# Altium schematic sheet SC942C_ETOR1.SchDoc: Entrées TOR 1/2
size 393 x 270 mm; CompanyName: Seccom; Address1: 521, rue du capt. François Garbit; Address2: 69440 Mornant; Address3: seccom@seccom.fr; Address4: www.seccom.fr; DocumentNumber: 3; SheetNumber: 3; SheetTotal: 8; PageSetup: Record=PageOptions|CenterHorizontal=True|CenterVertical=True|PrintScale=0.74|XCorrection=1.00|YCorrection=1.00|PrintKind=0|BorderSize=5000000|LeftOffset=0|BottomOffset=0|Orientation=2|PaperLength=1000|PaperWidth=1000|Scale=100|PaperSource=7|PrintQuality=-4|MediaType=1|DitherType=10|PaperKind=A4|PrintScaleMode=1
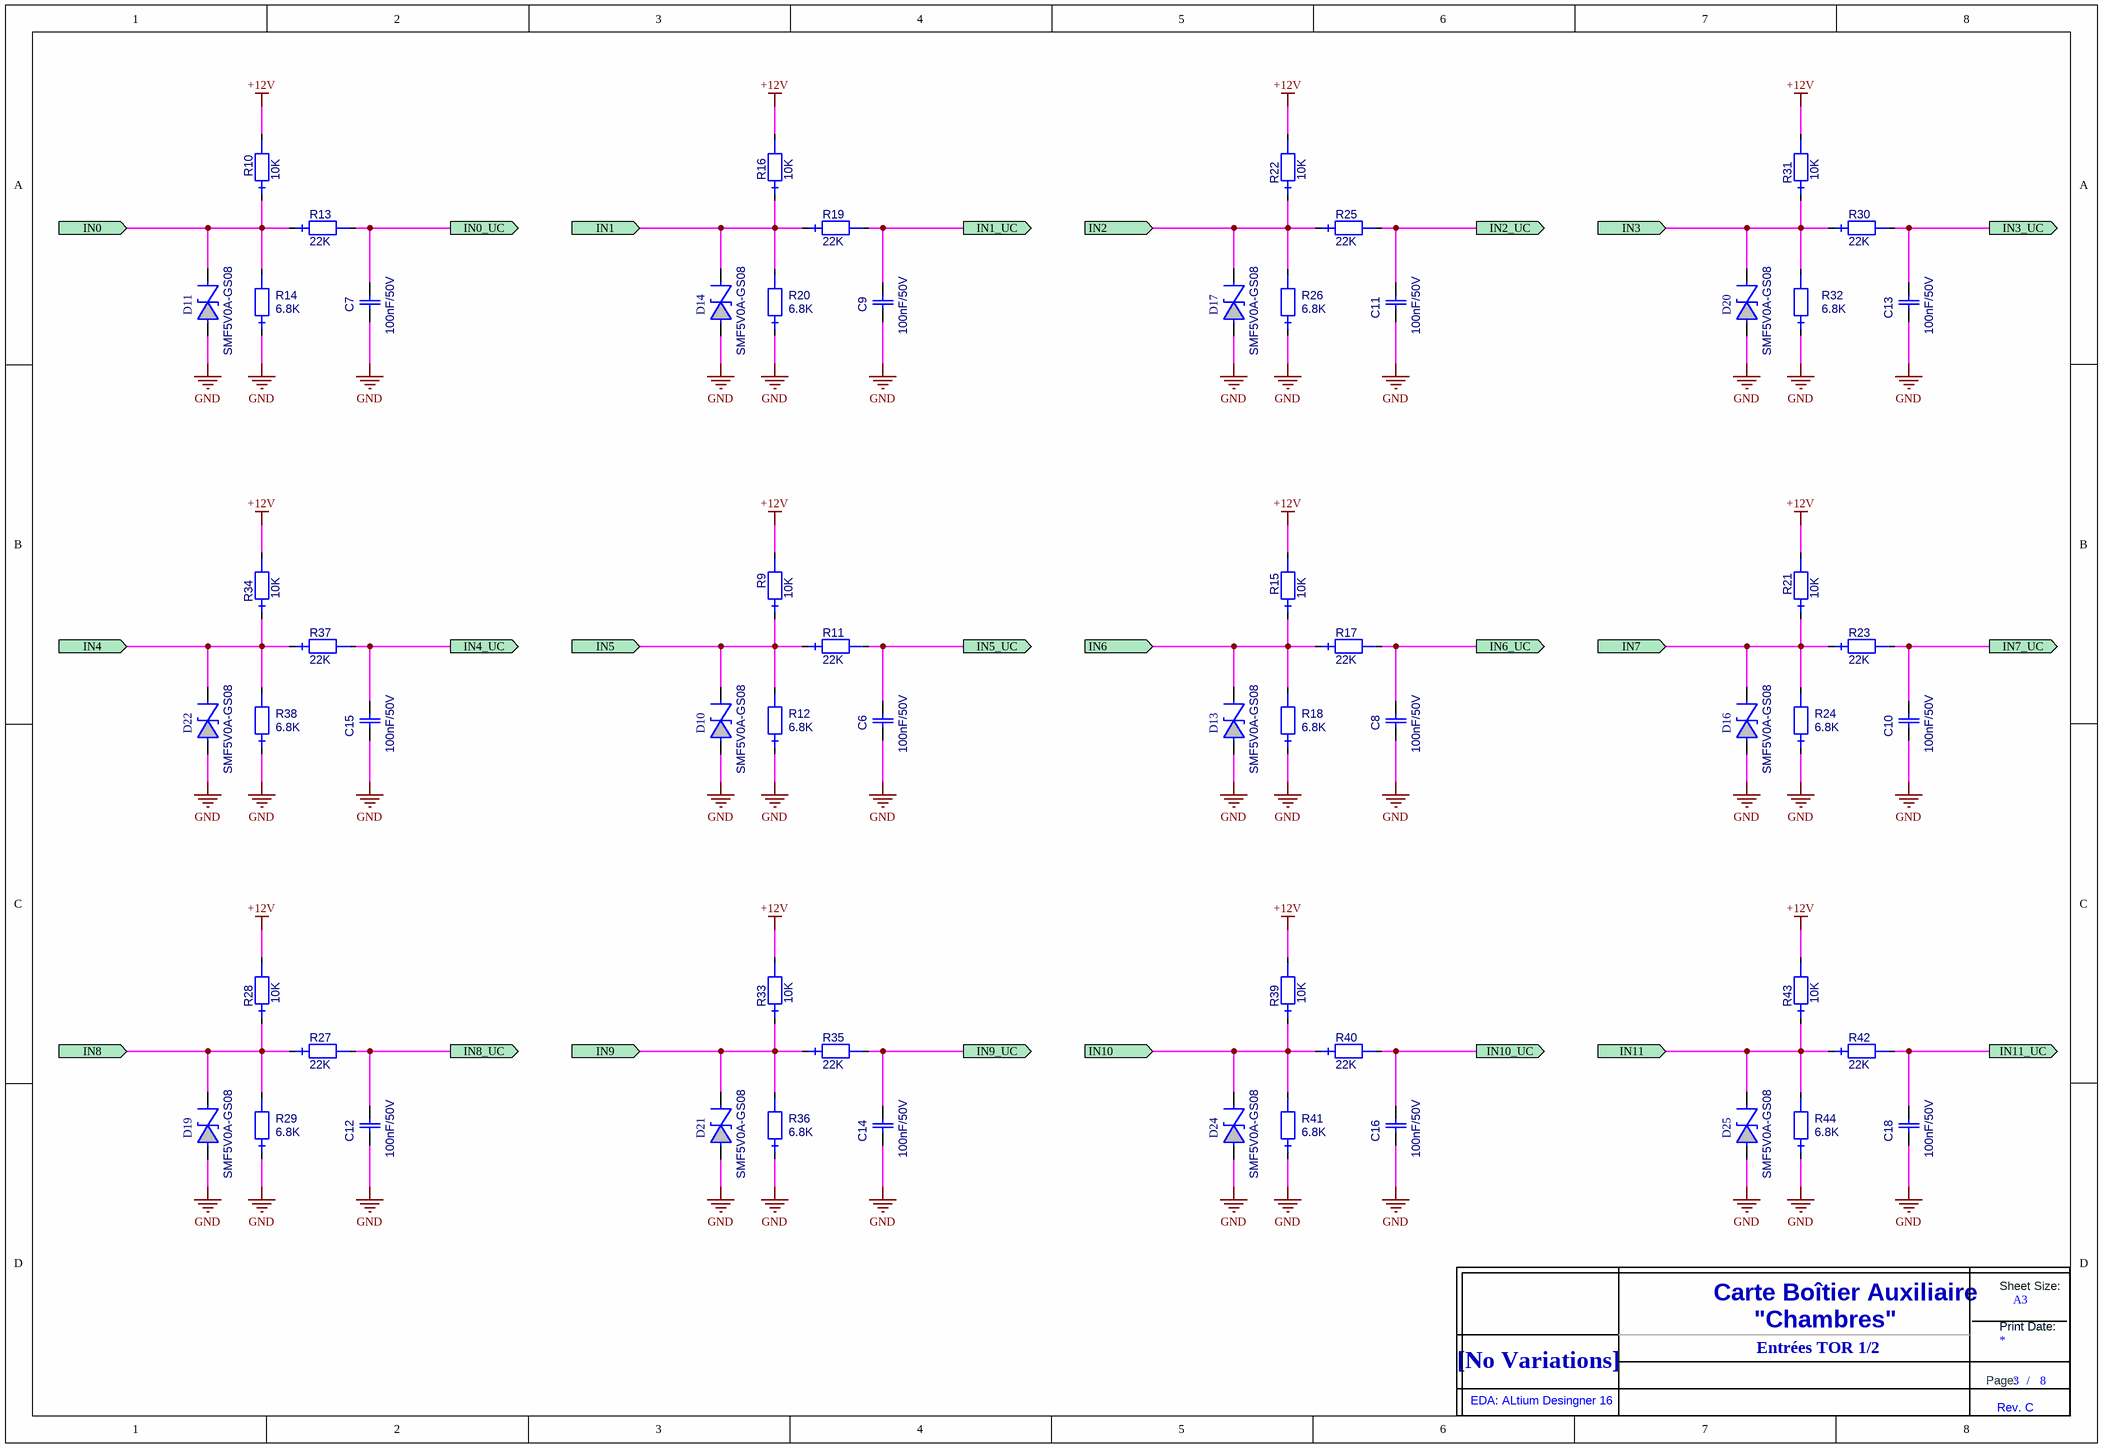
[diagram p0: SC942C_ETOR1.SchDoc]

## Parts
C6  value 100nF/50V  [0805_ReflowSoldering_CAP]  (hidden comment: C_0805_X7R_10%_100N-50V)
C7  value 100nF/50V  [0805_ReflowSoldering_CAP]  (hidden comment: C_0805_X7R_10%_100N-50V)
C8  value 100nF/50V  [0805_ReflowSoldering_CAP]  (hidden comment: C_0805_X7R_10%_100N-50V)
C9  value 100nF/50V  [0805_ReflowSoldering_CAP]  (hidden comment: C_0805_X7R_10%_100N-50V)
C10  value 100nF/50V  [0805_ReflowSoldering_CAP]  (hidden comment: C_0805_X7R_10%_100N-50V)
C11  value 100nF/50V  [0805_ReflowSoldering_CAP]  (hidden comment: C_0805_X7R_10%_100N-50V)
C12  value 100nF/50V  [0805_ReflowSoldering_CAP]  (hidden comment: C_0805_X7R_10%_100N-50V)
C13  value 100nF/50V  [0805_ReflowSoldering_CAP]  (hidden comment: C_0805_X7R_10%_100N-50V)
C14  value 100nF/50V  [0805_ReflowSoldering_CAP]  (hidden comment: C_0805_X7R_10%_100N-50V)
C15  value 100nF/50V  [0805_ReflowSoldering_CAP]  (hidden comment: C_0805_X7R_10%_100N-50V)
C16  value 100nF/50V  [0805_ReflowSoldering_CAP]  (hidden comment: C_0805_X7R_10%_100N-50V)
C18  value 100nF/50V  [0805_ReflowSoldering_CAP]  (hidden comment: C_0805_X7R_10%_100N-50V)
D10  SMF5V0A-GS08  [DO219AB-SMF-P_ReflowSoldering]
D11  SMF5V0A-GS08  [DO219AB-SMF-P_ReflowSoldering]
D13  SMF5V0A-GS08  [DO219AB-SMF-P_ReflowSoldering]
D14  SMF5V0A-GS08  [DO219AB-SMF-P_ReflowSoldering]
D16  SMF5V0A-GS08  [DO219AB-SMF-P_ReflowSoldering]
D17  SMF5V0A-GS08  [DO219AB-SMF-P_ReflowSoldering]
D19  SMF5V0A-GS08  [DO219AB-SMF-P_ReflowSoldering]
D20  SMF5V0A-GS08  [DO219AB-SMF-P_ReflowSoldering]
D21  SMF5V0A-GS08  [DO219AB-SMF-P_ReflowSoldering]
D22  SMF5V0A-GS08  [DO219AB-SMF-P_ReflowSoldering]
D24  SMF5V0A-GS08  [DO219AB-SMF-P_ReflowSoldering]
D25  SMF5V0A-GS08  [DO219AB-SMF-P_ReflowSoldering]
R9  value 10K  [0805_ReflowSoldering_RES]  (hidden comment: RES_0805_1%_100PPM_10K)
R10  value 10K  [0805_ReflowSoldering_RES]  (hidden comment: RES_0805_1%_100PPM_10K)
R11  value 22K  [0805_ReflowSoldering_RES]  (hidden comment: RES_0805_1%_100PPM_22K)
R12  value 6.8K  [0805_ReflowSoldering_RES]  (hidden comment: RES_0805_1%_100PPM_6.8K)
R13  value 22K  [0805_ReflowSoldering_RES]  (hidden comment: RES_0805_1%_100PPM_22K)
R14  value 6.8K  [0805_ReflowSoldering_RES]  (hidden comment: RES_0805_1%_100PPM_6.8K)
R15  value 10K  [0805_ReflowSoldering_RES]  (hidden comment: RES_0805_1%_100PPM_10K)
R16  value 10K  [0805_ReflowSoldering_RES]  (hidden comment: RES_0805_1%_100PPM_10K)
R17  value 22K  [0805_ReflowSoldering_RES]  (hidden comment: RES_0805_1%_100PPM_22K)
R18  value 6.8K  [0805_ReflowSoldering_RES]  (hidden comment: RES_0805_1%_100PPM_6.8K)
R19  value 22K  [0805_ReflowSoldering_RES]  (hidden comment: RES_0805_1%_100PPM_22K)
R20  value 6.8K  [0805_ReflowSoldering_RES]  (hidden comment: RES_0805_1%_100PPM_6.8K)
R21  value 10K  [0805_ReflowSoldering_RES]  (hidden comment: RES_0805_1%_100PPM_10K)
R22  value 10K  [0805_ReflowSoldering_RES]  (hidden comment: RES_0805_1%_100PPM_10K)
R23  value 22K  [0805_ReflowSoldering_RES]  (hidden comment: RES_0805_1%_100PPM_22K)
R24  value 6.8K  [0805_ReflowSoldering_RES]  (hidden comment: RES_0805_1%_100PPM_6.8K)
R25  value 22K  [0805_ReflowSoldering_RES]  (hidden comment: RES_0805_1%_100PPM_22K)
R26  value 6.8K  [0805_ReflowSoldering_RES]  (hidden comment: RES_0805_1%_100PPM_6.8K)
R27  value 22K  [0805_ReflowSoldering_RES]  (hidden comment: RES_0805_1%_100PPM_22K)
R28  value 10K  [0805_ReflowSoldering_RES]  (hidden comment: RES_0805_1%_100PPM_10K)
R29  value 6.8K  [0805_ReflowSoldering_RES]  (hidden comment: RES_0805_1%_100PPM_6.8K)
R30  value 22K  [0805_ReflowSoldering_RES]  (hidden comment: RES_0805_1%_100PPM_22K)
R31  value 10K  [0805_ReflowSoldering_RES]  (hidden comment: RES_0805_1%_100PPM_10K)
R32  value 6.8K  [0805_ReflowSoldering_RES]  (hidden comment: RES_0805_1%_100PPM_6.8K)
R33  value 10K  [0805_ReflowSoldering_RES]  (hidden comment: RES_0805_1%_100PPM_10K)
R34  value 10K  [0805_ReflowSoldering_RES]  (hidden comment: RES_0805_1%_100PPM_10K)
R35  value 22K  [0805_ReflowSoldering_RES]  (hidden comment: RES_0805_1%_100PPM_22K)
R36  value 6.8K  [0805_ReflowSoldering_RES]  (hidden comment: RES_0805_1%_100PPM_6.8K)
R37  value 22K  [0805_ReflowSoldering_RES]  (hidden comment: RES_0805_1%_100PPM_22K)
R38  value 6.8K  [0805_ReflowSoldering_RES]  (hidden comment: RES_0805_1%_100PPM_6.8K)
R39  value 10K  [0805_ReflowSoldering_RES]  (hidden comment: RES_0805_1%_100PPM_10K)
R40  value 22K  [0805_ReflowSoldering_RES]  (hidden comment: RES_0805_1%_100PPM_22K)
R41  value 6.8K  [0805_ReflowSoldering_RES]  (hidden comment: RES_0805_1%_100PPM_6.8K)
R42  value 22K  [0805_ReflowSoldering_RES]  (hidden comment: RES_0805_1%_100PPM_22K)
R43  value 10K  [0805_ReflowSoldering_RES]  (hidden comment: RES_0805_1%_100PPM_10K)
R44  value 6.8K  [0805_ReflowSoldering_RES]  (hidden comment: RES_0805_1%_100PPM_6.8K)
Title_new?  DNI  (value not drawn)  (graphical)

## Ports
IN0 (in), IN0_UC (out), IN1 (in), IN1_UC (out), IN2 (in), IN2_UC (out), IN3 (in), IN3_UC (out), IN4 (in), IN4_UC (out), IN5 (in), IN5_UC (out), IN6 (in), IN6_UC (out), IN7 (in), IN7_UC (out), IN8 (in), IN8_UC (out), IN9 (in), IN9_UC (out), IN10 (in), IN10_UC (out), IN11 (in), IN11_UC (out)

## Nets
+12V: R9.2 R10.2 R15.2 R16.2 R21.2 R22.2 R28.2 R31.2 R33.2 R34.2 R39.2 R43.2
GND: C6.1 C7.1 C8.1 C9.1 C10.1 C11.1 C12.1 C13.1 C14.1 C15.1 C16.1 C18.1 D10.A D11.A D13.A D14.A D16.A D17.A D19.A D20.A D21.A D22.A D24.A D25.A R12.1 R14.1 R18.1 R20.1 R24.1 R26.1 R29.1 R32.1 R36.1 R38.1 R41.1 R44.1
IN0: D11.K R10.1 R13.1 R14.2 ; port IN0
IN0_UC: C7.2 R13.2 ; port IN0_UC
IN1: D14.K R16.1 R19.1 R20.2 ; port IN1
IN1_UC: C9.2 R19.2 ; port IN1_UC
IN2: D17.K R22.1 R25.1 R26.2 ; port IN2
IN2_UC: C11.2 R25.2 ; port IN2_UC
IN3: D20.K R30.1 R31.1 R32.2 ; port IN3
IN3_UC: C13.2 R30.2 ; port IN3_UC
IN4: D22.K R34.1 R37.1 R38.2 ; port IN4
IN4_UC: C15.2 R37.2 ; port IN4_UC
IN5: D10.K R9.1 R11.1 R12.2 ; port IN5
IN5_UC: C6.2 R11.2 ; port IN5_UC
IN6: D13.K R15.1 R17.1 R18.2 ; port IN6
IN6_UC: C8.2 R17.2 ; port IN6_UC
IN7: D16.K R21.1 R23.1 R24.2 ; port IN7
IN7_UC: C10.2 R23.2 ; port IN7_UC
IN8: D19.K R27.1 R28.1 R29.2 ; port IN8
IN8_UC: C12.2 R27.2 ; port IN8_UC
IN9: D21.K R33.1 R35.1 R36.2 ; port IN9
IN9_UC: C14.2 R35.2 ; port IN9_UC
IN10: D24.K R39.1 R40.1 R41.2 ; port IN10
IN10_UC: C16.2 R40.2 ; port IN10_UC
IN11: D25.K R42.1 R43.1 R44.2 ; port IN11
IN11_UC: C18.2 R42.2 ; port IN11_UC

## Notes on the sheet
- Entrées TOR 1/2
- (in symbol Title_new_1) Sheet Size:; Carte Boîtier Auxiliaire; A3; "Chambres"; Print Date:; [No Variations]; Page:; /; EDA: ALtium Desingner 16; Rev. C

## Library data of the parts
C6-C16 C18 = C_0805_X7R_10%_100N-50V: Condensateur céramique, X7R, 10%, CMS 0805; Creation: LJ; Verification: LJ (28/05/04); Reference: 000042/00; Boitier: 0805; Remarque: {Remarque}; Fabricant: AVX; Ref Fab: 08055C104KAT2A; Coeff: 1; ComponentLink1URL: o:\_Documentation\Datasheets\BC_Components\Condo_CMS_NPO-X7R-Y5V.pdf; ComponentLink2URL: o:\_Documentation\Datasheets\_BOITIERS\PASSIF_CMS\RC_0805_(2x1,25)_(Schneider).PDF; Config: *; ComponentLink1Description: Datasheet; ComponentLink2Description: Datasheet Boitier; Supplier 1: Farnell; Supplier Part Number 1: 499687
D10 D11 D13 D14 D16 D17 D19-D22 D24 D25 = SMF5V0A-GS08: Diode Transil/TVS unidirectionnelle (A), 200W, 5V, CMS; Creation: LJ; Boitier: DO219AB/SMF; Remarque: {Remarque}; Fabricant: Vishay; Coeff: 1; Verification: *; Ref Fab: SMF5V0A-GS08; ComponentLink1URL: o:\_Documentation\Datasheets\Vishay\SMF5V0A~51A.pdf; ComponentLink2URL: o:\_Documentation\Datasheets\_BOITIERS\; Config: *; ComponentLink1Description: Datasheet; ComponentLink2Description: Datasheet Boitier; Value: SMF5V0A-GS08; Supplier 1: Farnell; Supplier 2: Mouser; Supplier Part Number 1: 1617696; Supplier Part Number 2: 78-SMF5V0A
R9 R10 R15 R16 R21 R22 R28 R31 R33 R34 R39 R43 = RES_0805_1%_100PPM_10K: Résistance CMS 0805, 0.125W, 1%, 100ppm, 150V; Creation: LJ (06/02/09); Reference: 000063/00; Boitier: 0805; Remarque: {Remarque}; Fabricant: Yageo; Ref Fab: RC0805FR-0710KL; Coeff: 1; Verification: *; ComponentLink1URL: o:\_Documentation\Datasheets\BC_Components\Resistances_ThickFilmFlatChip_0402-0603-0805-1206.pdf; ComponentLink2URL: o:\_Documentation\Datasheets\_BOITIERS\PASSIF_CMS\RC_0805_(2x1,25)_(Schneider).PDF; Config: *; ComponentLink1Description: Datasheet; ComponentLink2Description: Datasheet Boitier; Supplier 1: Farnell; Supplier Part Number 1: 9237755
R11 R13 R17 R19 R23 R25 R27 R30 R35 R37 R40 R42 = RES_0805_1%_100PPM_22K: Résistance CMS 0805, 0.125W, 1%, 100ppm, 150V; Creation: LJ (06/02/09); Reference: 000137/00; Boitier: 0805; Remarque: {Remarque}; Fabricant: Yageo; Ref Fab: RC0805FR-0722KL; Coeff: 1; Verification: *; ComponentLink1URL: o:\_Documentation\Datasheets\BC_Components\Resistances_ThickFilmFlatChip_0402-0603-0805-1206.pdf; ComponentLink2URL: o:\_Documentation\Datasheets\_BOITIERS\PASSIF_CMS\RC_0805_(2x1,25)_(Schneider).PDF; Config: *; ComponentLink1Description: Datasheet; ComponentLink2Description: Datasheet Boitier; Supplier 1: Farnell; Supplier Part Number 1: 9237798; Supplier 2: Mouser; Supplier Part Number 2: 603-RC0805FR-0722KL
R12 R14 R18 R20 R24 R26 R29 R32 R36 R38 R41 R44 = RES_0805_1%_100PPM_6.8K: Résistance CMS 0805, 0.125W, 1%, 100ppm, 150V; Creation: LJ (06/02/09); Reference: 000129/00; Boitier: 0805; Remarque: {Remarque}; Fabricant: Yageo; Ref Fab: RC0805FR-076K8L; Coeff: 1; Verification: *; ComponentLink1URL: o:\_Documentation\Datasheets\BC_Components\Resistances_ThickFilmFlatChip_0402-0603-0805-1206.pdf; ComponentLink2URL: o:\_Documentation\Datasheets\_BOITIERS\PASSIF_CMS\RC_0805_(2x1,25)_(Schneider).PDF; Config: *; ComponentLink1Description: Datasheet; ComponentLink2Description: Datasheet Boitier; Supplier 1: Farnell; Supplier Part Number 1: 9237739; Supplier 2: Mouser; Supplier Part Number 2: 603-RC0805FR-076K8L
Title_new? = Title_new_1